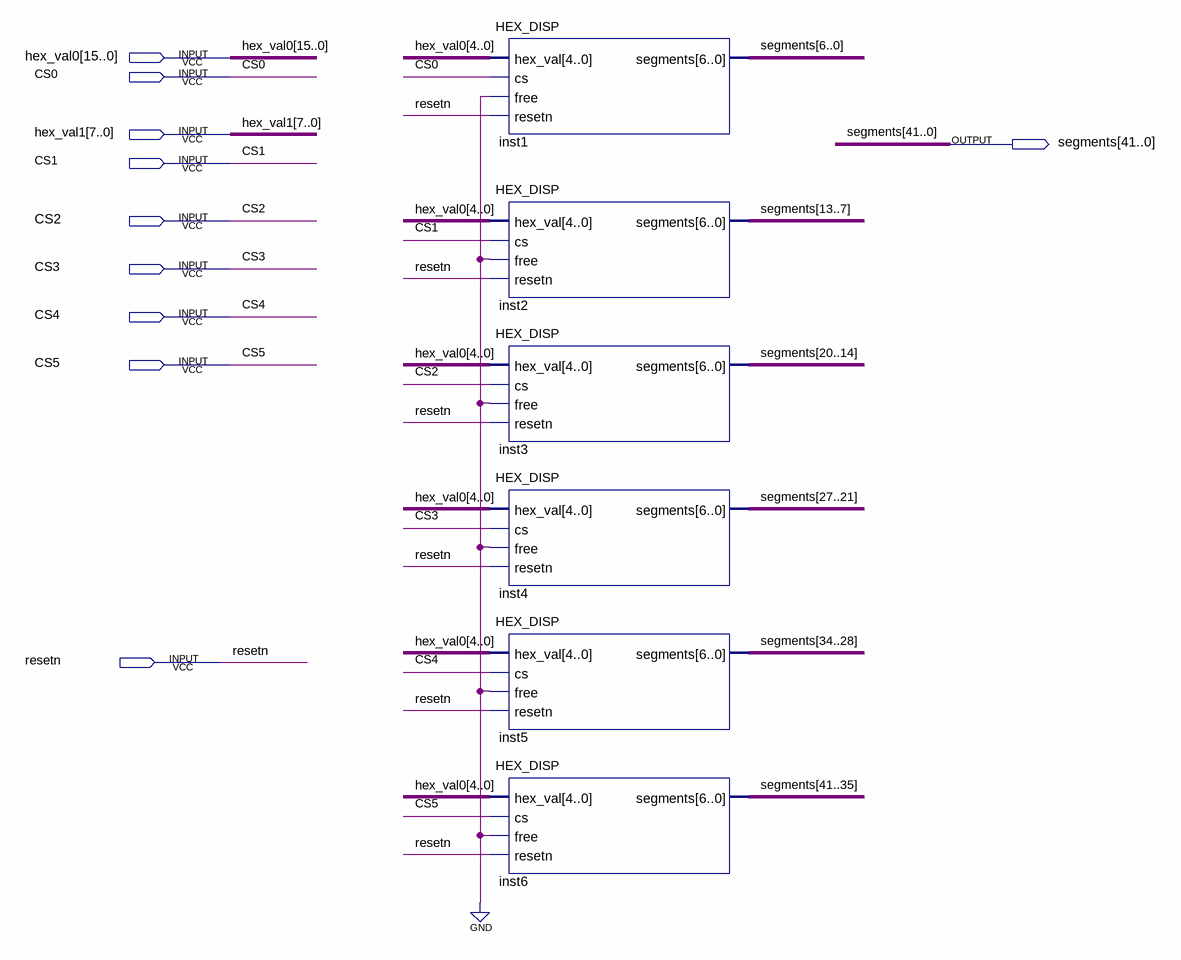
[diagram p0: schematic sheet]
// Quartus schematic HEX_DISP_6.bdf as structural Verilog: 6 symbols, 10 pins
module HEX_DISP_6 (
  input  [15:0] hex_val0,
  input  CS0,
  input  [7:0] hex_val1,
  input  CS1,
  input  CS2,
  input  CS3,
  input  CS4,
  input  CS5,
  input  resetn,
  output [41:0] segments
);

  HEX_DISP inst1 (.hex_val(hex_val0[4:0]), .cs(CS0), .free(1'b0), .resetn(resetn), .segments(segments[6:0]));
  HEX_DISP inst2 (.hex_val(hex_val0[4:0]), .cs(CS1), .free(1'b0), .resetn(resetn), .segments(segments[13:7]));
  HEX_DISP inst3 (.hex_val(hex_val0[4:0]), .cs(CS2), .free(1'b0), .resetn(resetn), .segments(segments[20:14]));
  HEX_DISP inst4 (.hex_val(hex_val0[4:0]), .cs(CS3), .free(1'b0), .resetn(resetn), .segments(segments[27:21]));
  HEX_DISP inst5 (.hex_val(hex_val0[4:0]), .cs(CS4), .free(1'b0), .resetn(resetn), .segments(segments[34:28]));
  HEX_DISP inst6 (.hex_val(hex_val0[4:0]), .cs(CS5), .free(1'b0), .resetn(resetn), .segments(segments[41:35]));
endmodule
